# Altium schematic sheet uc.SchDoc
size A4
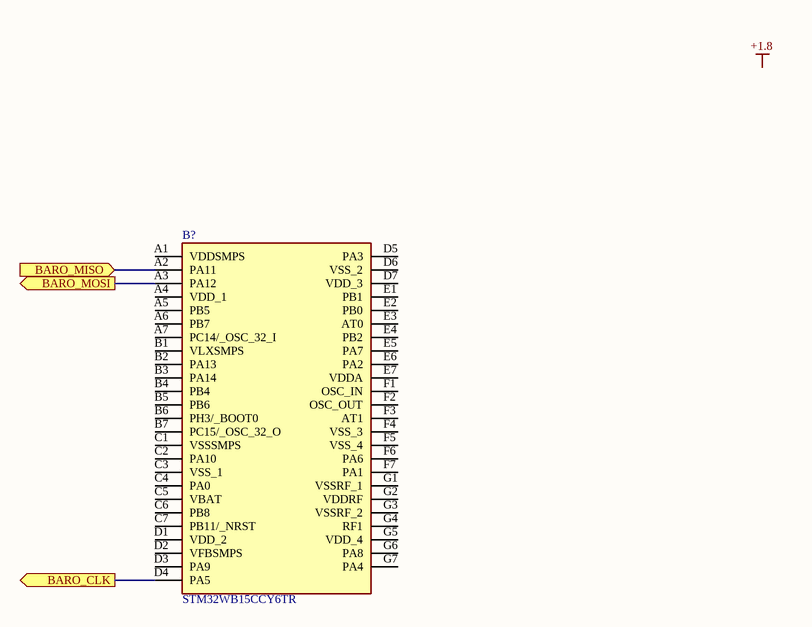
[diagram p0: uc.SchDoc]

## Parts
B?  STM32WB15CCY6TR  [STM32WB15CCY6TR]

## Ports
BARO_CLK (out), BARO_MISO (in), BARO_MOSI (out)

## Nets
BARO_CLK: B?.D4(PA5) ; port BARO_CLK
BARO_MISO: B?.A2(PA11) ; port BARO_MISO
BARO_MOSI: B?.A3(PA12) ; port BARO_MOSI

Not connected (* = marked no-connect by the designer): B? A1(VDDSMPS) A4(VDD_1) A5(PB5) A6(PB7) A7(PC14/_OSC_32_I) B1(VLXSMPS) B2(PA13) B3(PA14) B4(PB4) B5(PB6) B6(PH3/_BOOT0) B7(PC15/_OSC_32_O) C1(VSSSMPS) C2(PA10) C3(VSS_1) C4(PA0) C5(VBAT) C6(PB8) C7(PB11/_NRST) D1(VDD_2) D2(VFBSMPS) D3(PA9) D5(PA3) D6(VSS_2) D7(VDD_3) E1(PB1) E2(PB0) E3(AT0) E4(PB2) E5(PA7) E6(PA2) E7(VDDA) F1(OSC_IN) F2(OSC_OUT) F3(AT1) F4(VSS_3) F5(VSS_4) F6(PA6) F7(PA1) G1(VSSRF_1) G2(VDDRF) G3(VSSRF_2) G4(RF1) G5(VDD_4) G6(PA8) G7(PA4)

## Notes on the sheet
- Labels drawn without touching a wire or pin: +1.8

## Library data of the parts
B? = STM32WB15CCY6TR: RF Microcontrollers - MCU; Manufacturer_Name: STMicroelectronics; Geometry.Height: 0.59mm; Mouser Part Number: 511-STM32WB15CCY6TR; Mouser Price/Stock: https://www.mouser.co.uk/ProductDetail/STMicroelectronics/STM32WB15CCY6TR?qs=iLbezkQI%252Bsj12q8ZKMWwPg%3D%3D; Manufacturer_Part_Number: STM32WB15CCY6TR; Datasheet Link: https://www.st.com/resource/en/datasheet/stm32wb15cc.pdf